# Altium schematic sheet DIG_S3C_MultiChannelFunnel.SchDoc
size A4; Organization: UltraZohm; SheetNumber: 22
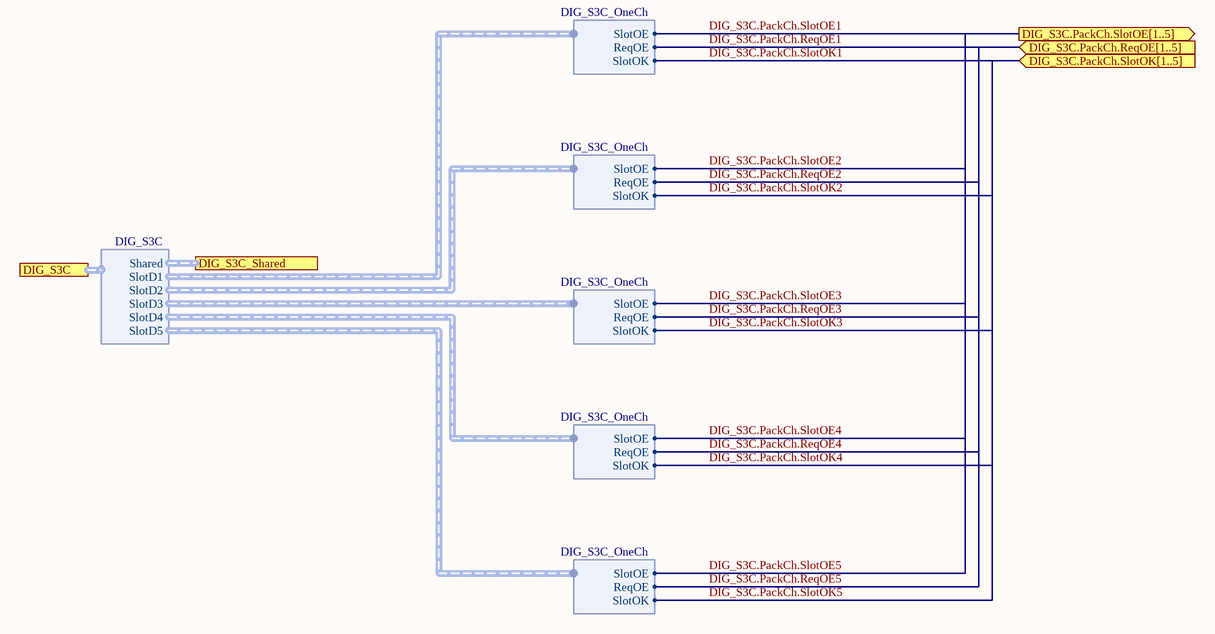
[diagram p0: DIG_S3C_MultiChannelFunnel.SchDoc]

## Ports
DIG_S3C (harness DIG_S3C), DIG_S3C.PackCh.ReqOE[1..5] (in), DIG_S3C.PackCh.SlotOE[1..5] (out), DIG_S3C.PackCh.SlotOK[1..5] (in), DIG_S3C_Shared (harness DIG_S3C_Shared)

## Harnesses
DIG_S3C: Shared, SlotD1, SlotD2, SlotD3, SlotD4, SlotD5
DIG_S3C_OneCh: SlotOE, ReqOE, SlotOK

## Nets
DIG_S3C.PackCh.ReqOE1: harness DIG_S3C_OneCh.ReqOE
DIG_S3C.PackCh.ReqOE2: harness DIG_S3C_OneCh.ReqOE
DIG_S3C.PackCh.ReqOE3: harness DIG_S3C_OneCh.ReqOE
DIG_S3C.PackCh.ReqOE4: harness DIG_S3C_OneCh.ReqOE
DIG_S3C.PackCh.ReqOE5: harness DIG_S3C_OneCh.ReqOE
DIG_S3C.PackCh.SlotOE1: harness DIG_S3C_OneCh.SlotOE
DIG_S3C.PackCh.SlotOE2: harness DIG_S3C_OneCh.SlotOE
DIG_S3C.PackCh.SlotOE3: harness DIG_S3C_OneCh.SlotOE
DIG_S3C.PackCh.SlotOE4: harness DIG_S3C_OneCh.SlotOE
DIG_S3C.PackCh.SlotOE5: harness DIG_S3C_OneCh.SlotOE
DIG_S3C.PackCh.SlotOK1: harness DIG_S3C_OneCh.SlotOK
DIG_S3C.PackCh.SlotOK2: harness DIG_S3C_OneCh.SlotOK
DIG_S3C.PackCh.SlotOK3: harness DIG_S3C_OneCh.SlotOK
DIG_S3C.PackCh.SlotOK4: harness DIG_S3C_OneCh.SlotOK
DIG_S3C.PackCh.SlotOK5: harness DIG_S3C_OneCh.SlotOK

## Notes on the sheet
- Title
- Revision:
- Design Engineer:
- Date:
- Project:
- Sheet
- of